# Altium schematic sheet DevBoard.SchDoc
size A3
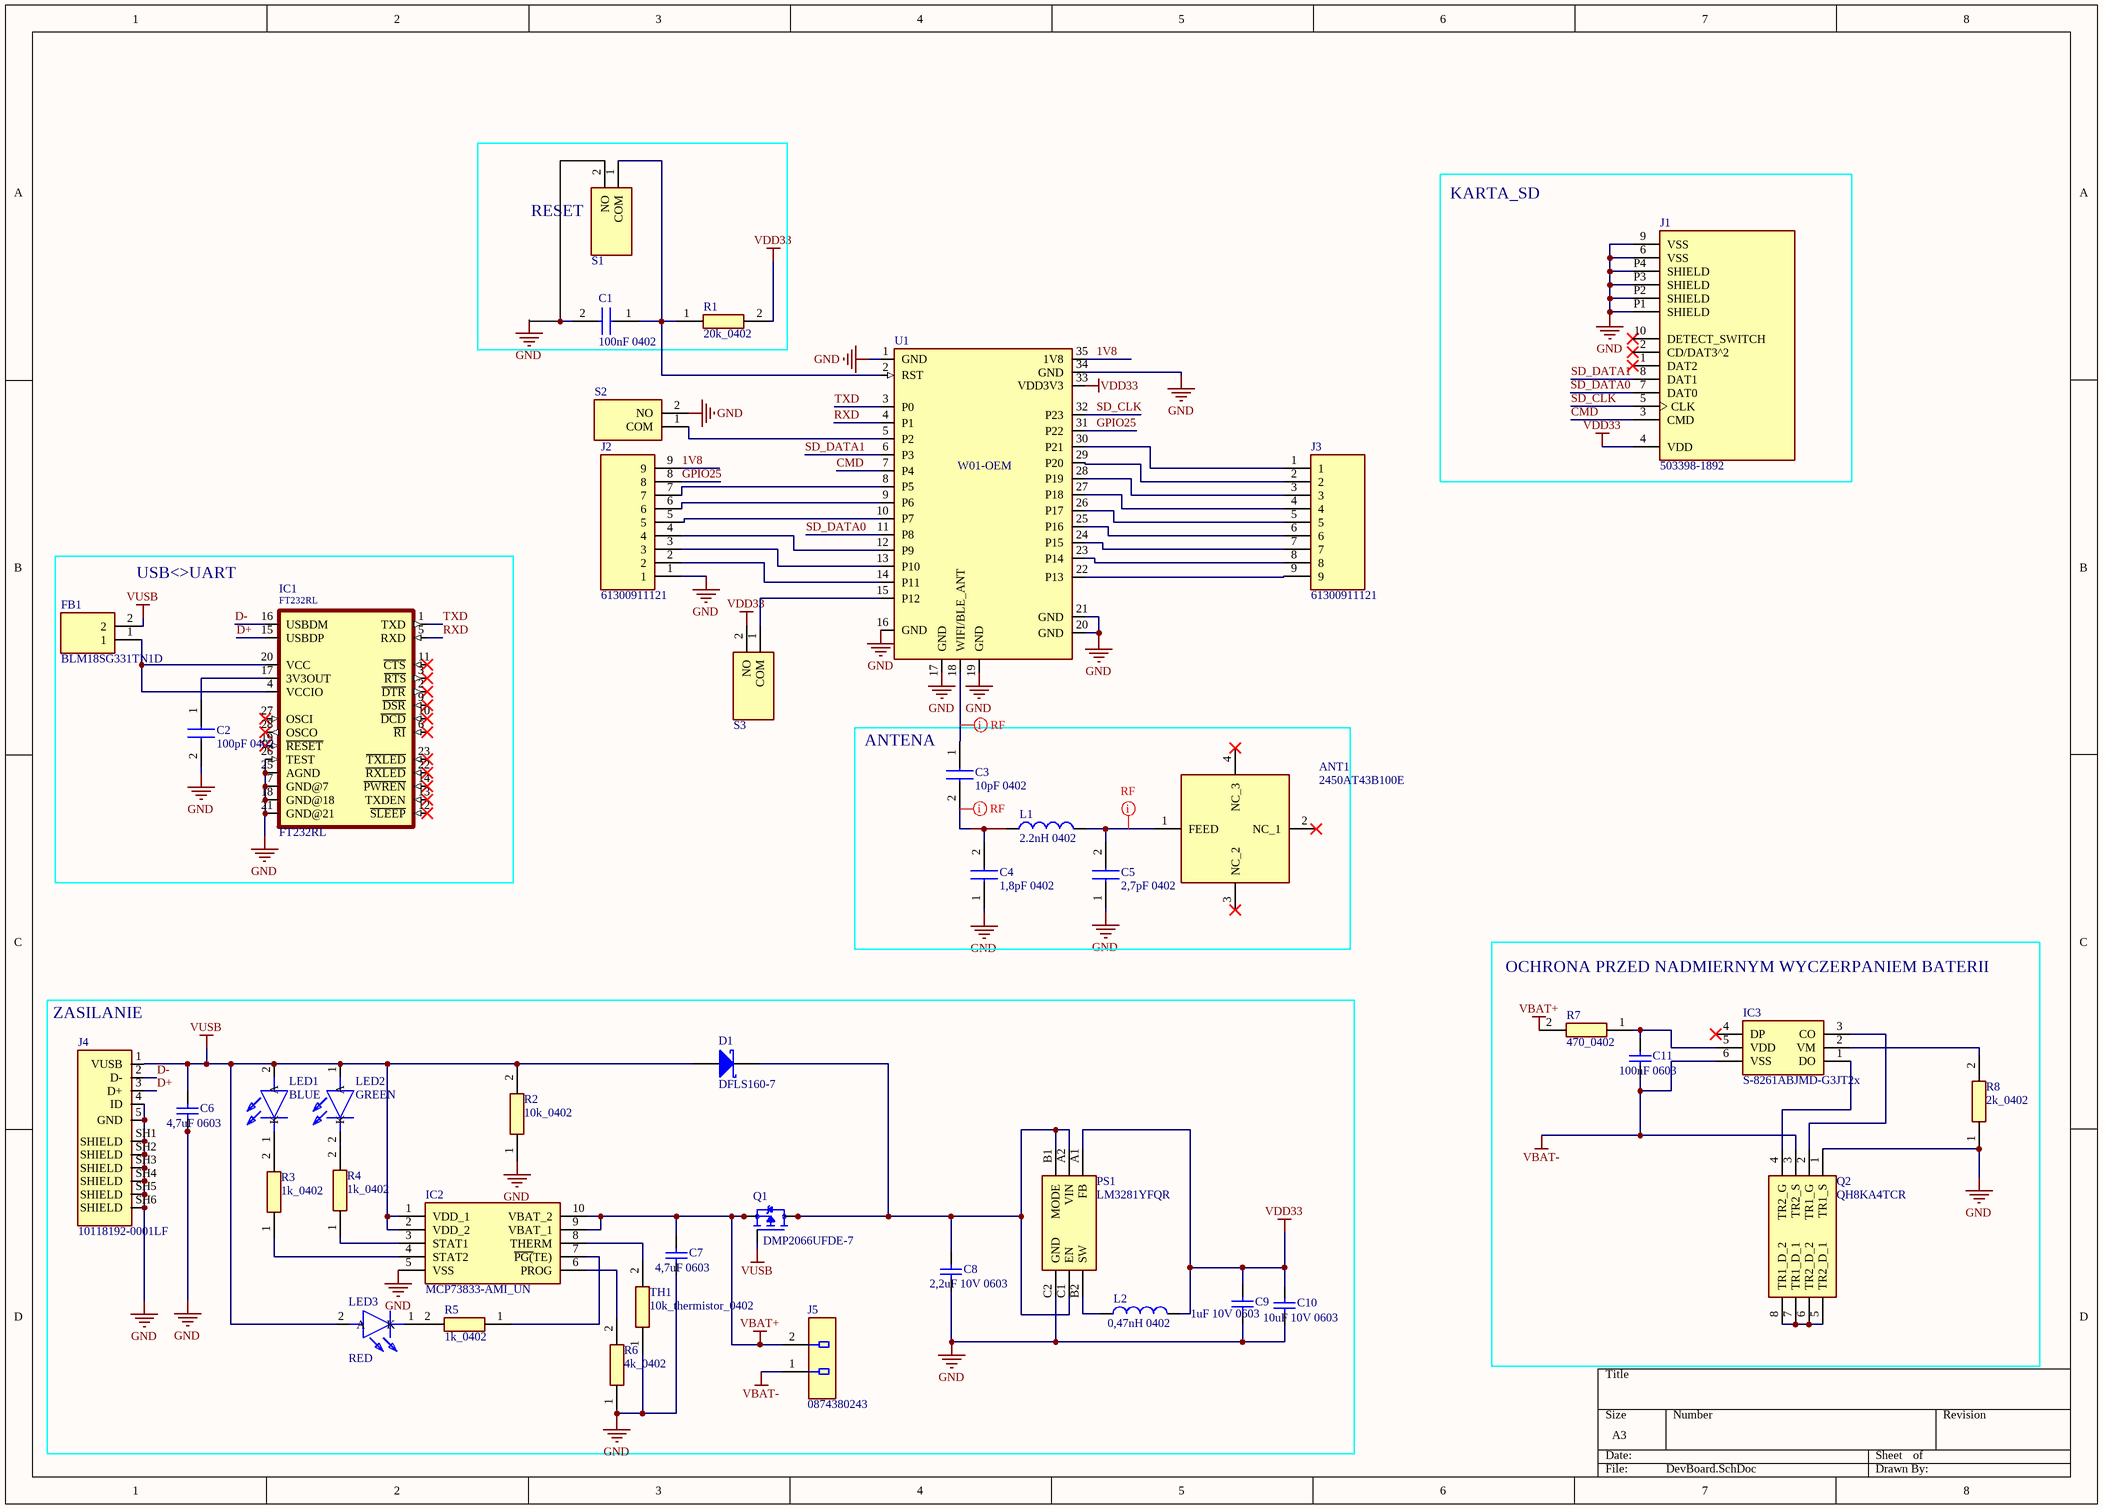
[diagram p0: DevBoard.SchDoc]

## Parts
ANT1  2450AT43B100E  [2450AT43B100E]
C1  100nF 0402  [CAPC1005X56N]
C2  100pF 0402  [CAPC1005X56N]
C3  10pF 0402  [CAPC1005X56N]
C4  1,8pF 0402  [CAPC1005X56N]
C5  2,7pF 0402  [CAPC1005X56N]
C6  4,7uF 0603  [CAPC0603(1608)100_L]
C7  4,7uF 0603  [CAPC0603(1608)100_L]
C8  2,2uF 10V 0603  [CAPC0603(1608)100_L]
C9  1uF 10V 0603  [CAPC0603(1608)100_L]
C10  10uF 10V 0603  [CAPC0603(1608)100_L]
C11  100nF 0603  [CAPC0603(1608)100_L]
D1  DFLS160-7  [DIOD-POWERDI123-2_V]
FB1  BLM18SG331TN1D  [BLM18SG121TN1J]
IC1  FT232RL  [SSOP28-LD]
IC2  MCP73833-AMI_UN  [SOP50P490X110-10N]
IC3  S-8261ABJMD-G3JT2x  [SOT95P275X135-6N]
J1  503398-1892  [MOLEX_503398-1892]
J2  61300911121  [HDRV9W95P0X254_1X9_2286X254X874P]
J3  61300911121  [HDRV9W95P0X254_1X9_2286X254X874P]
J4  10118192-0001LF  [101181920001LF]
J5  Part Number: 0874380243  [Molex_0874380243_0]  (hidden comment: Conn_Molex_0874380243_eec)
L1  2.2nH 0402  [INDC1006X60X20LL10T10]
L2  0,47nH 0402  [INDC1006X60X20LL10T10]
LED1  BLUE  [KBDELPS212QHRI24Z55510S]
LED2  GREEN  [KGDELLS122JGKH24]
LED3  RED  [KRDELPS122UHVI26H3Q4]
PS1  LM3281YFQR  [BGA6C40P2X3_116X144X68]
Q1  DMP2066UFDE-7  [MOSFET_DMP2066UFDE-7]
Q2  QH8KA4TCR  [SOTFL65P280X85-8N]
R1  20k_0402  [RESC1005X40N]
R2  10k_0402  [RESC1005X40N]
R3  1k_0402  [RESC1005X40N]
R4  1k_0402  [RESC1005X40N]
R5  1k_0402  [RESC1005X40N]
R6  4k_0402  [RESC1005X40N]
R7  470_0402  [RESC1005X40N]
R8  2k_0402  [RESC1005X40N]
S1  PTS636_SM43J_SMTR_LFS  [PTS636SM43JSMTRLFS]  (value not drawn)
S2  PTS636_SM43J_SMTR_LFS  [PTS636SM43JSMTRLFS]  (value not drawn)
S3  PTS636_SM43J_SMTR_LFS  [PTS636SM43JSMTRLFS]  (value not drawn)
TH1  10k_thermistor_0402  [RESC1005X40N]
U1  W01-OEM  [PYCOM_W01-OEM]

## Blocks framed on the sheet
RESET: C1 R1 S1
KARTA_SD: J1
USB<>UART: C2 FB1 IC1
ANTENA: ANT1 C3-C5 L1
OCHRONA PRZED NADMIERNYM WYCZERPANIEM BATERII: C11 IC3 Q2 R7 R8
ZASILANIE: C6-C10 D1 IC2 J4 J5 L2 LED1-LED3 PS1 Q1 R2-R6 TH1

## Nets
GND: C1.2 C2.2 C4.1 C5.1 C6.1 C7.1 C8.1 C9.1 C10.1 IC1.7(GND@7) IC1.18(GND@18) IC1.21(GND@21) IC1.25(AGND) IC1.26(TEST) IC2.5(VSS) J1.6(VSS) J1.9(VSS) J1.P1(SHIELD) J1.P2(SHIELD) J1.P3(SHIELD) J1.P4(SHIELD) J2.1 J4.4(ID) J4.5(GND) J4.SH1(SHIELD) J4.SH2(SHIELD) J4.SH3(SHIELD) J4.SH4(SHIELD) J4.SH5(SHIELD) J4.SH6(SHIELD) PS1.C2(GND) Q2.1(TR1_S) R2.1 R6.1 R8.1 S1.2(NO) S2.2(NO) TH1.1 U1.1(GND) U1.16(GND) U1.17(GND) U1.19(GND) U1.20(GND) U1.21(GND) U1.34(GND)
VBAT+: C7.2 IC2.9(VBAT_1) IC2.10(VBAT_2) J5.2 Q1.4(S) Q1.7(S) R7.2
VBAT-: C11.1 IC3.6(VSS) J5.1 Q2.3(TR2_S)
VDD33: C9.2 C10.2 J1.4(VDD) L2.2 PS1.A1(FB) R1.2 S3.2(NO) U1.33(VDD3V3)
VUSB: C6.2 D1.1(A) FB1.2 IC2.1(VDD_1) IC2.2(VDD_2) J4.1(VUSB) LED1.2(A) LED2.1(A) LED3.2(A) Q1.3(G) R2.2
1V8: J2.9 U1.35(1V8)
CMD: J1.3(CMD) U1.7(P4)
D+: IC1.15(USBDP) J4.3(D+)
D-: IC1.16(USBDM) J4.2(D-)
GPIO25: J2.8 U1.31(P22)
RXD: IC1.5(RXD) U1.4(P1)
SD_CLK: J1.5(CLK) U1.32(P23)
SD_DATA0: J1.7(DAT0) U1.11(P8)
SD_DATA1: J1.8(DAT1) U1.6(P3)
TXD: IC1.1(TXD) U1.3(P0)
NetANT1_1: ANT1.1(FEED) C5.2 L1.2
NetC1_1: C1.1 R1.1 S1.1(COM) U1.2(RST)
NetC2_1: C2.1 IC1.17(3V3OUT)
NetC3_1: C3.1 U1.18(WIFI/BLE_ANT)
NetC3_2: C3.2 C4.2 L1.1
NetC8_2: C8.2 D1.2(K) PS1.A2(VIN) PS1.B1(MODE) PS1.C1(EN) Q1.1(D) Q1.2(D) Q1.5(D) Q1.6(D)
NetC11_2: C11.2 IC3.5(VDD) R7.1
NetFB1_1: FB1.1 IC1.4(VCCIO) IC1.20(VCC)
NetIC2_3: IC2.3(STAT1) R4.1
NetIC2_4: IC2.4(STAT2) R3.1
NetIC2_6: IC2.6(PROG) R6.2
NetIC2_7: IC2.7(~{PG(}TE)) R5.1
NetIC2_8: IC2.8(THERM) TH1.2
NetIC3_1: IC3.1(DO) Q2.4(TR2_G)
NetIC3_2: IC3.2(VM) R8.2
NetIC3_3: IC3.3(CO) Q2.2(TR1_G)
NetJ2_2: J2.2 U1.14(P11)
NetJ2_3: J2.3 U1.13(P10)
NetJ2_4: J2.4 U1.12(P9)
NetJ2_5: J2.5 U1.10(P7)
NetJ2_6: J2.6 U1.9(P6)
NetJ2_7: J2.7 U1.8(P5)
NetJ3_1: J3.1 U1.30(P21)
NetJ3_2: J3.2 U1.29(P20)
NetJ3_3: J3.3 U1.28(P19)
NetJ3_4: J3.4 U1.27(P18)
NetJ3_5: J3.5 U1.26(P17)
NetJ3_6: J3.6 U1.25(P16)
NetJ3_7: J3.7 U1.24(P15)
NetJ3_8: J3.8 U1.23(P14)
NetJ3_9: J3.9 U1.22(P13)
NetL2_1: L2.1 PS1.B2(SW)
NetLED1_1: LED1.1(K) R3.2
NetLED2_2: LED2.2(K) R4.2
NetLED3_1: LED3.1(K) R5.2
NetQ2_5: Q2.5(TR2_D_1) Q2.6(TR2_D_2) Q2.7(TR1_D_1) Q2.8(TR1_D_2)
NetS2_1: S2.1(COM) U1.5(P2)
NetS3_1: S3.1(COM) U1.15(P12)

Not connected (* = marked no-connect by the designer): ANT1 2(NC_1)* 3(NC_2)* 4(NC_3)*; IC1 2(~{DTR})* 3(~{RTS})* 6(~{RI})* 9(~{DSR})* 10(~{DCD})* 11(~{CTS})* 12(~{SLEEP})* 13(TXDEN)* 14(~{PWREN})* 19(~{RESET})* 22(~{RXLED})* 23(~{TXLED})* 27(OSCI)* 28(OSCO)*; IC3 4(DP)*; J1 1(DAT2)* 2(CD/DAT3^2)* 10(DETECT_SWITCH)*

## Layout directives
net class RF: NetANT1_1, NetC3_1, NetC3_2

## Library data of the parts
ANT1 = 2450AT43B100E: Antenna; Manufacturer_Name: JOHANSON TECHNOLOGY; Datasheet Link: https://componentsearchengine.com/Datasheets/2/2450AT43B100E.pdf; Height: 2.1mm; Manufacturer_Part_Number: 2450AT43B100E; Arrow Part Number: 2450AT43B100E; Arrow Price/Stock: https://www.arrow.com/en/products/2450at43b100e/johanson-dielectrics; Mouser Part Number: 609-2450AT43B100E; Mouser Price/Stock: https://www.mouser.co.uk/ProductDetail/Johanson-Technology/2450AT43B100E?qs=yCnrNFeXz%252Bg12F05%252B89fnA%3D%3D
C1-C5 = 04025A1R8BAT2A: Capacitor; Manufacturer_Name: AVX; Datasheet Link: http://www.mouser.com/catalog/supplier/library/pdf/AVXSurfaceMountCeramic.pdf; Height: 0.56mm; Manufacturer_Part_Number: 04025A1R8BAT2A; Arrow Part Number: 04025A1R8BAT2A; Mouser Part Number: 581-04025A1R8BAT2A; Mouser Price/Stock: https://www.mouser.com/Search/Refine.aspx?Keyword=581-04025A1R8BAT2A
C6-C11 = CMP-1035-02734-1: CAP 1uF 10V ±20% 0603 (1608 Metric) Thickness 1mm SMD; Tolerance: Â±20%; Case-EIA: 0603; Case-Metric: 1608; Technology: SMT; Value: 1uF; Max Thickness: 1 mm; Rated Voltage: 10 V
D1 = CMP-2000-07449-1: Schottky Barrier Rectifier, 60 V, 1 A, -65 to 150 degC, 2-Pin SMD, RoHS, Tape and Reel; Manufacturer: Diodes Inc; Current Rating: 1A; Polarity: Standard; Max Repetitive Reverse Voltage (Vrrm): 60V; Peak Reverse Current: 100uA; Forward Voltage: 500mV; Max Forward Surge Current (Ifsm): 50A; Capacitance: 67pF; Case\/Package: SMD/SMT; Element Configuration: Single; Contact Plating: Matte; Mounting Technology: SurfaceMount; Package Quantity: 3000; Min Operating Temperature: -65degC; Length: 2.8mm; Packaging: TapeandReel; Package Reference: POWERDI123-2; Lead Free: LeadFree; Average Rectified Current: 1A; REACH SVHC: NoSVHC; Mount: SurfaceMount; Package Description: 2-Pin Small Outline Diode, Body 2.8 x 1.78 mm; Datasheet URL: https://www.diodes.com/assets/Datasheets/ds30548.pdf; Manufacturer URL: http://www.diodes.com/; Number of Pins: 2; Max Operating Temperature: 150degC; Reverse Voltage (DC): 60V; Voltage Rating (DC): 60V; Peak Non-Repetitive Surge Current: 50A; Radiation Hardening: No; Datasheet Version: Rev. 8-2, 05/2017; RoHSCompliant: true; Height: 0.98mm; Output Current: 1A; Width: 1.78mm; Termination: SMD/SMT; Forward Current: 1A
FB1 = BLM18SG331TN1D: Ferrite Bead; Manufacturer_Name: Murata Electronics; Datasheet Link: https://www.murata.com/en-us/products/productdetail?partno=BLM18SG331TN1%23; Height: 0.75mm; Manufacturer_Part_Number: BLM18SG331TN1D; Arrow Part Number: BLM18SG331TN1D; Arrow Price/Stock: https://www.arrow.com/en/products/blm18sg331tn1d/murata-manufacturing; Mouser Part Number: 81-BLM18SG331TN1D; Mouser Price/Stock: https://www.mouser.co.uk/ProductDetail/Murata-Electronics/BLM18SG331TN1D?qs=Hp4IEBVVqKI2B%252BK%252BkpMX7w%3D%3D
IC1 = FT232RL: USB ë¸Œë¦¬ì§€, USB-UART USB 2.0 UART ì¸í„°íŽ˜ì´ìŠ¤ 28-SSOP; MF: FTDI, Future; Package: SSOP-28 FTDI, Future; Price: None; Availability: Unavailable; MP: FT232RL; SnapEDA_Link: https://www.snapeda.com/parts/FT232RL/FTDI%2C%20Future%20Technology%20Devices%20International%20Ltd/view-part/1077088/?ref=snap; Value: *
IC2 = MCP73833-AMI_UN: Integrated Circuit; Manufacturer_Name: Microchip; Manufacturer_Part_Number: MCP73833-AMI/UN; Datasheet Link: http://componentsearchengine.com/Datasheets/1/MCP73833-AMI_UN.pdf; Height: 1.1mm; Arrow Part Number: MCP73833-AMI/UN; Arrow Price/Stock: https://www.arrow.com/en/products/mcp73833-amiun/microchip-technology; Mouser Part Number: 579-MCP73833-AMI/UN; Mouser Price/Stock: https://www.mouser.co.uk/ProductDetail/Microchip-Technology/MCP73833-AMI-UN?qs=Fxu3fLyJv8fd%2FGnsUSC9lg%3D%3D
IC3 = S-8261ACMMD-G4MT2U: Integrated Circuit; Manufacturer_Name: ABLIC U.S.A. Inc.; Datasheet Link: https://www.mouser.fr/datasheet/2/360/S8261_E-1365905.pdf; Height: 1.35mm; Manufacturer_Part_Number: S-8261ABJMD-G3JT2x; Arrow Part Number: S-8261ABJMD-G3JT2x; Mouser Part Number: 628-S8261ACMMDG4MT2G; Mouser Price/Stock: https://www.mouser.com/Search/Refine.aspx?Keyword=628-S8261ACMMDG4MT2G
J1 = 503398-1892: 9 _8 + 1_ Position Card Connector microSDâ„¢ Surface Mount, Right Angle Gold; MP: 5033981892; MF: Molex; SnapEDA_Link: https://www.snapeda.com/parts/5033981892/Molex/view-part/1614473/?ref=snap; Digi-Key_Part_Number: WM11190CT-ND; Digi-Key_Purchase_URL: https://www.digikey.com/product-detail/en/molex/5033981892/WM11190CT-ND/5230912?utm_source=snapeda&utm_medium=aggregator&utm_campaign=symbol; Value: *; Package: None
J2 J3 = 61300911121: Connector; Manufacturer_Name: Wurth Elektronik; Datasheet Link: http://uk.rs-online.com/web/p/products/8281608; Height: 8.74mm; Manufacturer_Part_Number: 61300911121; Arrow Part Number: 61300911121; Mouser Part Number: 710-61300911121; Mouser Price/Stock: https://www.mouser.com/Search/Refine.aspx?Keyword=710-61300911121
J4 = 10118192-0001LF: USB - micro B USB 2.0 Receptacle Connector 5 Position Surface Mount, Right Angle; MF: Amphenol ICC; Availability: Unavailable; Price: None; Package: None; MP: 10118192-0001LF; Value: *; SnapEDA_Link: https://www.snapeda.com/parts/10118192-0001LF/Amphenol%20FCI/view-part/2897676/?ref=snap
J5 = Conn_Molex_0874380243_eec: CONN HEADER 2POS 1.5MM R/A SMD; Manufacturer: Molex; helpURL: https://upverter.com/upn/revision/9247828ede5b33c1/; ComponentLink2Description: Datasheet; Temperature: -55°C to +105°C; Package: HDR02; Supplier 2: Mouser; Price: 0.47257560661; Supplier 1: Digi-Key; ComponentLink1URL: https://upverter.com/upn/revision/9247828ede5b33c1/; Supplier Part Number 2: 538-87438-0243; Supplier Part Number 1: WM7646CT-ND; ComponentLink1Description: Upverter; ComponentLink2URL: http://www.molex.com/pdm_docs/sd/874380243_sd.pdf; RoHS: TRUE; Mouser Part Number: 538-87438-0243; Temperature Range High: +105°C; Digikey Description: CONN HEADER 2POS 1.5MM R/A SMD; Digikey Part Number: WM7646CT-ND; Temperature Range Low: -55°C; Lead Free: yes
L1 L2 = CMP-2000-06594-1: Chip Inductor, 10 nH, +/- 5%, 500 mA, -55 to 125 degC, 0402 (1005 Metric), RoHS, Tape and Reel; Manufacturer: Murata; Inductance-Nom: 10nH; Type: Molded; DC Resistance: 0.17O; Rated Current-Max: 500mA; Manufacturer URL: http://www.murata.com/; Tolerance (%): ±5%; Datasheet Version: 09/2012; Package Reference: 0402; Package Description: 2-Pin Surface Mount Device, Body 1 x 0.6 mm; Mounting Technology: SurfaceMount; Case Size/Dimension: 0402; Datasheet URL: http://search.murata.co.jp/Ceramy/image/img/PDF/ENG/L0075S0080LQW15A_00.pdf
LED1 = KB_DELPS2.12-QHRI-24-Z555-10-S: LED_BLUE; Manufacturer_Name: OSRAM; Manufacturer_Part_Number: KB DELPS2.12-QHRI-24-Z555-10-S; Datasheet Link: https://www.mouser.in/ProductDetail/OSRAM-Opto-Semiconductors/KB-DELPS212-QHRI-24-Z555-10-S?qs=%2Fha2pyFaduguGXnxUQPQvOwqvA0l1GbBGsJPdL2BNxwU00XGTd8yf8CXZb0fb41Mz9FjufZkGgQ%3D; Arrow Part Number: KB DELPS2.12-QHRI-24-Z555-10-S; Mouser Part Number: 720-KBDELPS212A6350; Mouser Price/Stock: https://www.mouser.co.uk/ProductDetail/OSRAM-Opto-Semiconductors/KB-DELPS212-QHRI-24-Z555-10-S?qs=OTrKUuiFdkb2rezknsx9mQ%3D%3D
LED2 = KG_DELLS1.22-JGKH-24: LED_GREEN; Manufacturer_Name: OSRAM; Manufacturer_Part_Number: KG DELLS1.22-JGKH-24; Datasheet Link: https://dammedia.osram.info/media/resource/hires/osram-dam-5423212/KG%20DELLS1.22_EN.pdf; Arrow Part Number: KG DELLS1.22-JGKH-24; Arrow Price/Stock: https://www.arrow.com/en/products/kg-dells1.22-jgkh-24/osram-opto-semiconductors; Mouser Part Number: 720-KGDELLS122A4849; Mouser Price/Stock: https://www.mouser.co.uk/ProductDetail/OSRAM-Opto-Semiconductors/KG-DELLS122-JGKH-24?qs=XeJtXLiO41QWpmNP80zu3g%3D%3D
LED3 = KR_DELPS1.22-UHVI-26-H3Q4: LED_RED; Manufacturer_Name: OSRAM; Manufacturer_Part_Number: KR DELPS1.22-UHVI-26-H3Q4; Datasheet Link: https://www.mouser.co.uk/ProductDetail/OSRAM-Opto-Semiconductors/KR-DELPS122-UHVI-26-H3Q4?qs=sGAEpiMZZMseGfSY3csMkXiJOH5X%252BfXw4kv80xILcLqjWCSyCkalLg%3D%3D; Arrow Part Number: KR DELPS1.22-UHVI-26-H3Q4; Mouser Part Number: 720-KRDELPS122A5163; Mouser Price/Stock: https://www.mouser.co.uk/ProductDetail/OSRAM-Opto-Semiconductors/KR-DELPS122-UHVI-26-H3Q4?qs=XeJtXLiO41Rxc1kIEv94zQ%3D%3D
PS1 = LM3281YFQR: Power Supply; Manufacturer_Name: Texas Instruments; Datasheet Link: http://www.ti.com/lit/gpn/lm3281; Height: 0.675mm; Manufacturer_Part_Number: LM3281YFQR; Arrow Part Number: LM3281YFQR; Arrow Price/Stock: https://www.arrow.com/en/products/lm3281yfqr/texas-instruments; Mouser Part Number: 595-LM3281YFQR; Mouser Price/Stock: https://www.mouser.com/Search/Refine.aspx?Keyword=595-LM3281YFQR
Q1 = DMP2066UFDE-7: P-Channel 20V 6.2A (Ta) 660mW (Ta) Surface Mount U-DFN2020-6 (Type E); MF: Diodes Inc.; SnapEDA_Link: https://www.snapeda.com/parts/DMP2066UFDE-7/Diodes%20Inc./view-part/488338/?ref=snap; Price: None; Availability: Unavailable; MP: DMP2066UFDE-7; Value: *; DigiKey-Purchase-URL: https://snapeda.com/shop?store=DigiKey&id=488338; Package: UDFN-6 Diodes Inc.
Q2 = QH8KA4TCR: MOSFET (N-Channel); Manufacturer_Name: ROHM Semiconductor; Datasheet Link: https://www.rohm.com/datasheet/QH8KA4/qh8ka4tcr-e; Height: 0.85mm; Manufacturer_Part_Number: QH8KA4TCR; Arrow Part Number: QH8KA4TCR; Mouser Part Number: 755-QH8KA4TCR; Mouser Price/Stock: https://www.mouser.co.uk/ProductDetail/ROHM-Semiconductor/QH8KA4TCR?qs=4v%252BiZTmLVHGNdU9QexsYgA%3D%3D
R1-R8 = CR0402-FX-2002GLF: Resistor; Manufacturer_Name: Bourns; Datasheet Link: https://www.bourns.com/pdfs/CR0402.pdf; Height: 0.4mm; Manufacturer_Part_Number: CR0402-FX-2002GLF; Arrow Part Number: CR0402-FX-2002GLF; Mouser Part Number: 652-CR0402FX-2002GLF; Mouser Price/Stock: https://www.mouser.com/Search/Refine.aspx?Keyword=652-CR0402FX-2002GLF
S1-S3 = PTS636_SM43J_SMTR_LFS: Switch; Manufacturer_Name: C & K COMPONENTS; Manufacturer_Part_Number: PTS636 SM43J SMTR LFS; Datasheet Link: https://componentsearchengine.com/Datasheets/1/PTS636 SM43J SMTR LFS.pdf; Height: 4.3mm; Arrow Part Number: PTS636 SM43J SMTR LFS; Arrow Price/Stock: https://www.arrow.com/en/products/pts636-sm43j-smtr-lfs/ck; Mouser Part Number: 611-PTS636SM43JSMTRL; Mouser Price/Stock: https://www.mouser.co.uk/ProductDetail/CK/PTS636-SM43J-SMTR-LFS?qs=vLWxofP3U2wboJ6ciMafNg%3D%3D
TH1 = CR0402-FX-2002GLF: NCU15XH103D60RC; Manufacturer_Name: Bourns; Datasheet Link: https://www.bourns.com/pdfs/CR0402.pdf; Height: 0.4mm; Manufacturer_Part_Number: CR0402-FX-2002GLF; Arrow Part Number: CR0402-FX-2002GLF; Mouser Part Number: 652-CR0402FX-2002GLF; Mouser Price/Stock: https://www.mouser.com/Search/Refine.aspx?Keyword=652-CR0402FX-2002GLF
U1 = W01-OEM: The W01 is the WiPy OEM module. It works exactly like your WiPy but weâ€™ve trimmed a few bits to make it smaller and easier to integrate. Dual network BLE and WiFi.; MF: Pycom; Value: *; Availability: Unavailable; Price: None; SnapEDA_Link: https://www.snapeda.com/parts/W01-OEM/Pycom/view-part/1039089/?ref=snap; Package: None; MP: W01-OEM